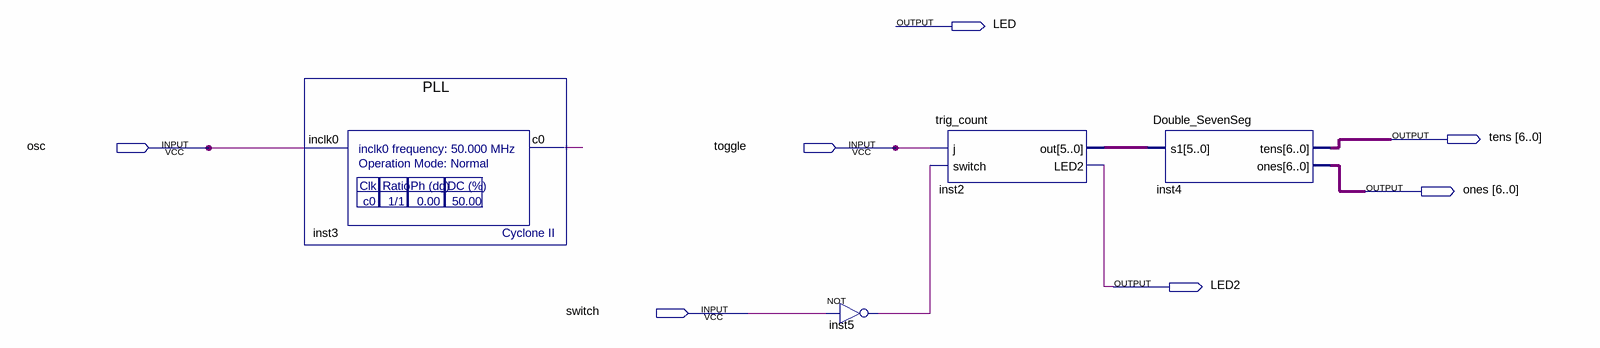
[diagram p0: schematic sheet]
// Quartus schematic TimeBinCount.bdf as structural Verilog: 4 symbols, 7 pins
module TimeBinCount (
  input  osc,
  input  toggle,
  input  switch,
  output LED,
  output [6:0] tens,
  output [6:0] ones,
  output LED2
);

  wire inst3_c0, inst5_out;
  wire [5:0] inst2_out;

  PLL inst3 (.inclk0(osc), .c0(inst3_c0));
  not inst5 (inst5_out, switch);
  trig_count inst2 (.j(toggle), .switch(inst5_out), .out(inst2_out), .LED2(LED2));
  Double_SevenSeg inst4 (.s1(inst2_out), .tens(tens), .ones(ones));
endmodule
